# EAGLE design PoElli-at (EAGLE 6.4)
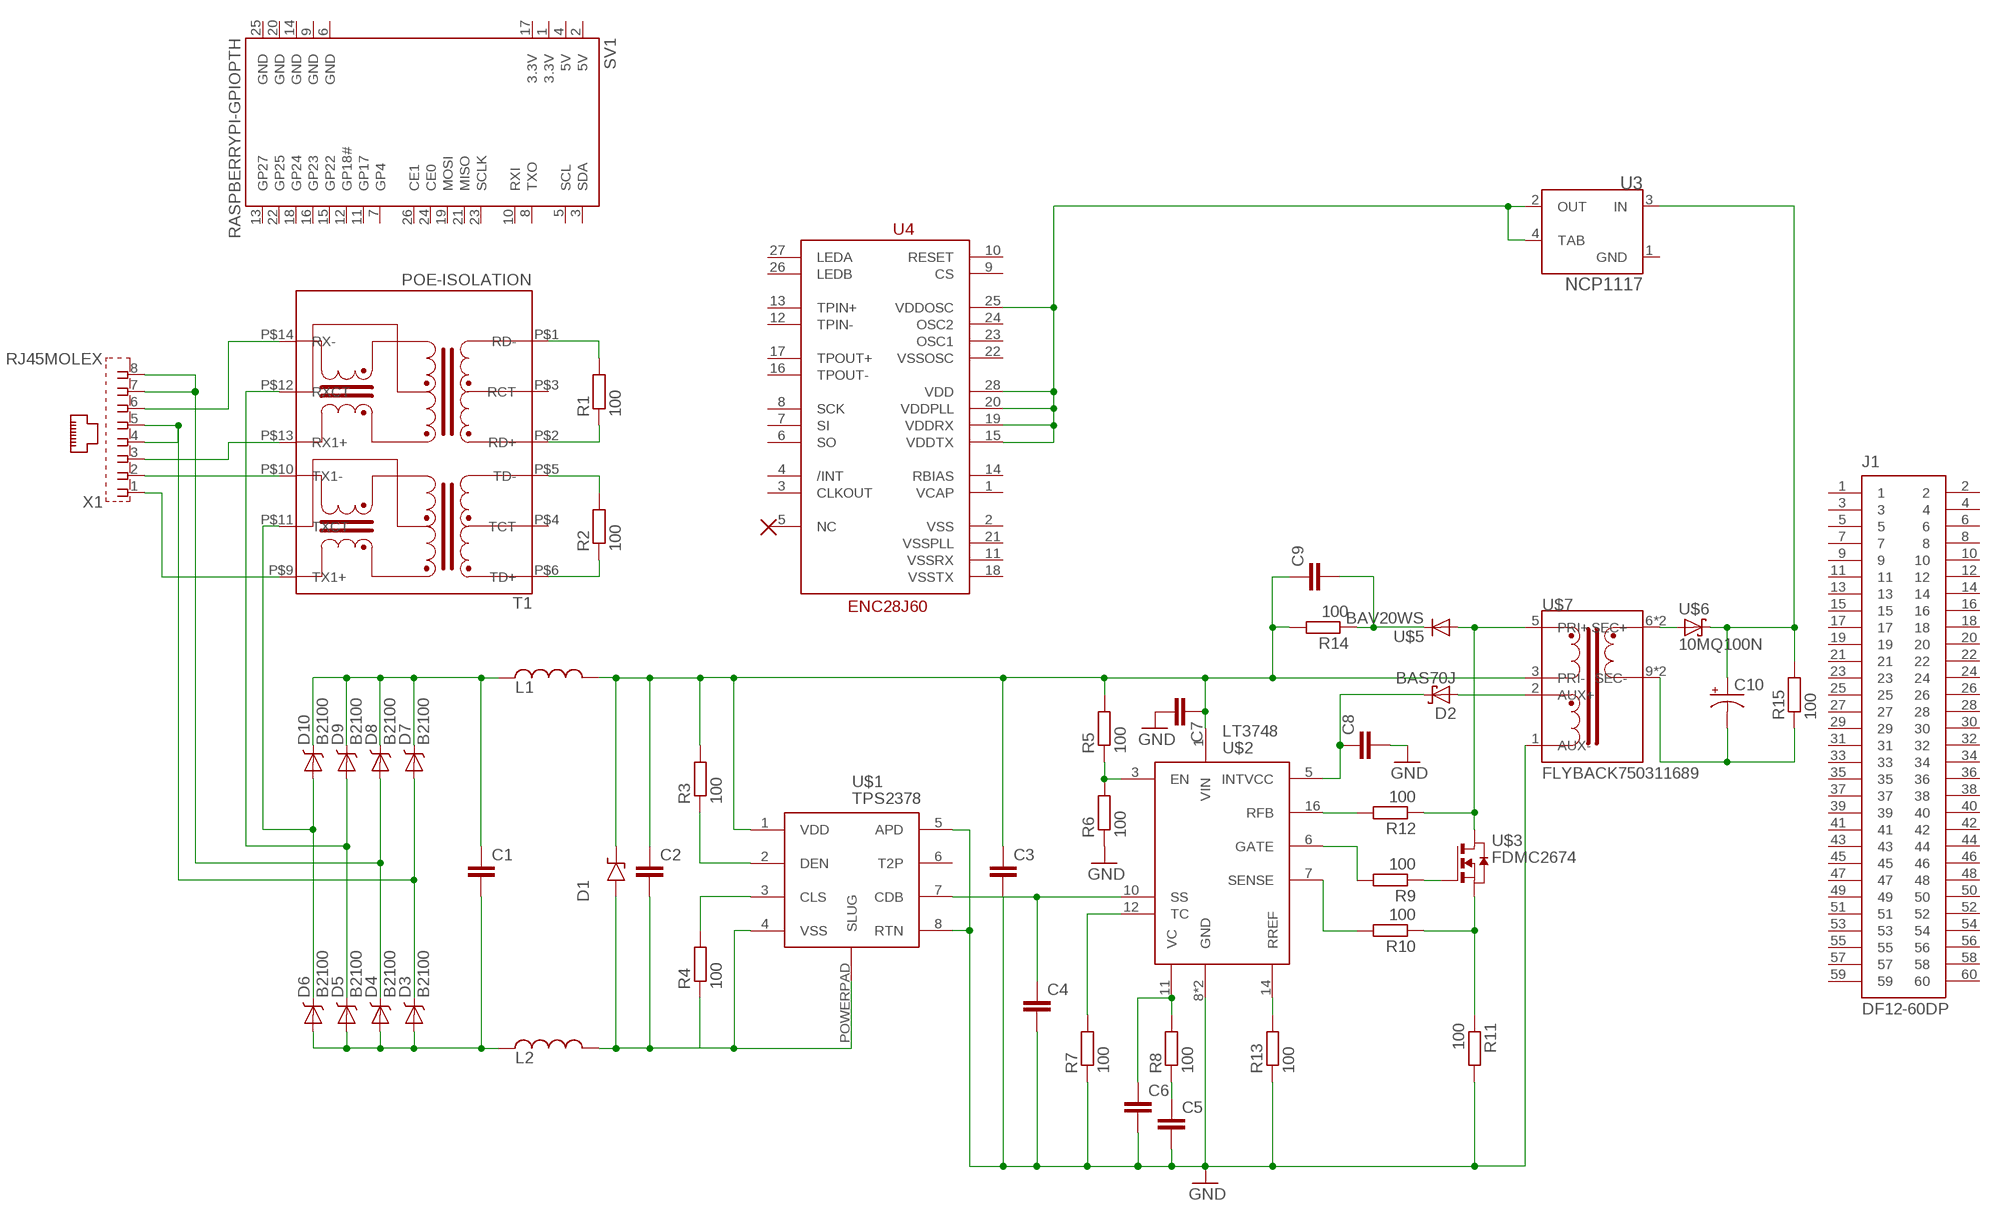
[diagram p0: schematic, sheet 1]

## Parts
C1  C0805  [C0805]
C2  C0805  [C0805]
C3  C0805  [C0805]
C4  C0603  [C0603]
C5  C0402  [C0402]
C6  C0805  [C0805]
C7  C0805  [C0805]
C8  C0805  [C0805]
C9  C0805  [C0805]
C10  CPOL6032  [CT6032]
D1  SMAJ58A  [SMA]
D2  BAS70J  [SOD323]
D3  B2100  DIODE-SCHOTTKYB2100  [DIODE-B2100]
D4  B2100  DIODE-SCHOTTKYB2100  [DIODE-B2100]
D5  B2100  DIODE-SCHOTTKYB2100  [DIODE-B2100]
D6  B2100  DIODE-SCHOTTKYB2100  [DIODE-B2100]
D7  B2100  DIODE-SCHOTTKYB2100  [DIODE-B2100]
D8  B2100  DIODE-SCHOTTKYB2100  [DIODE-B2100]
D9  B2100  DIODE-SCHOTTKYB2100  [DIODE-B2100]
D10  B2100  DIODE-SCHOTTKYB2100  [DIODE-B2100]
J1  DF12-60DP  [DF12(4.0)-60DP-0.5V]
L1  FB  [COILCRAFT-MSS5121]
L2  FB  [COILCRAFT-MSS5121]
R1  100  R0603  [R0603]
R2  100  R0603  [R0603]
R3  100  R0402  [R0402]
R4  100  R0402  [R0402]
R5  100  R0402  [R0402]
R6  100  R0402  [R0402]
R7  100  R0402  [R0402]
R8  100  R0402  [R0402]
R9  100  R0603  [R0603]
R10  100  R0402  [R0402]
R11  100  R1206  [R1206]
R12  100  R0402  [R0402]
R13  100  R0402  [R0402]
R14  100  R0805  [R0805]
R15  100  R0805  [R0805]
SV1  RASPBERRYPI-GPIOPTH  [2X13-SHROUDED]
T1  POE-ISOLATION  [COILCRAFT-ETH1-230L]
U3  NCP1117  [SOT223]
U4  ENC28J60  [SSOP28DB]
U$1  TPS2378  [SO08-POWERPAD]
U$2  LT3748  [MSOP16(12)]
U$3  FDMC2674  [MLP8L33]
U$5  BAV20WS  [SOD323]
U$6  10MQ100N  [DO214AC]
U$7  FLYBACK750311689  [WE_EP13_SMD_10PIN]
X1  RJ45MOLEX  [MOLEX-43860-0001]

## Nets
GND: C3.2 C4.2 C5.2 C6.2 C7.2 C8.2 R6.1 R7.1 R11.2 R13.1 U$1.5(APD) U$1.8(RTN) U$2.8(GND) U$2.9(GND) U$7.1(AUX-)
N$1: T1.P$10(TX1-) X1.2
N$2: T1.P$9(TX1+) X1.1
N$3: T1.P$13(RX1+) X1.3
N$4: T1.P$14(RX-) X1.6
N$5: D4.C D8.A X1.7 X1.8
N$6: C1.1 D7.C D8.C D9.C D10.C L1.1
N$7: D3.C D7.A X1.4 X1.5
N$8: C1.2 D3.A D4.A D5.A D6.A L2.1
N$9: D5.C D9.A T1.P$12(RXCT)
N$10: D6.C D10.A T1.P$11(TXCT)
N$11: R1.2 T1.P$1(RD-)
N$12: R1.1 T1.P$2(RD+)
N$13: R2.2 T1.P$5(TD-)
N$14: R2.1 T1.P$6(TD+)
N$15: C2.2 D1.2(A) L2.2 R4.1 U$1.4(VSS) U$1.POWERPAD(SLUG)
N$16: C2.1 C3.1 C7.1 C9.1 D1.1(C) L1.2 R3.2 R5.2 R14.2 U$1.1(VDD) U$2.1(VIN) U$7.3(PRI-)
N$17: R5.1 R6.2 U$2.3(EN)
N$18: R3.1 U$1.2(DEN)
N$19: R4.2 U$1.3(CLS)
N$20: C4.1 U$1.7(CDB) U$2.10(SS)
N$21: R7.2 U$2.12(TC)
N$22: C6.1 R8.2 U$2.11(VC)
N$23: C5.1 R8.1
N$24: R9.2 U$2.6(GATE)
N$25: R9.1 U$3.4(G)
N$26: R10.2 U$2.7(SENSE)
N$27: R10.1 R11.1 U$3.1(S) U$3.2(S) U$3.3(S)
N$28: R12.1 U$3.5(D) U$3.6(D) U$3.7(D) U$3.8(D) U$3.F1(D) U$5.1(A) U$7.5(PRI+)
N$29: D2.1(A) U$7.2(AUX+)
N$30: C8.1 D2.2(C) U$2.5(INTVCC)
N$31: R12.2 U$2.16(RFB)
N$32: R13.2 U$2.14(RREF)
N$33: C9.2 R14.1 U$5.2(C)
N$34: U$6.A U$7.6(SEC+) U$7.7(SEC+)
N$35: C10.P$1(+) R15.2 U3.3(IN) U$6.C
N$36: C10.P$2(-) R15.1 U$7.9(SEC-) U$7.10(SEC-)
N$37: U3.2(OUT) U3.4(TAB) U4.15(VDDTX) U4.19(VDDRX) U4.20(VDDPLL) U4.25(VDDOSC) U4.28(VDD)
Unconnected: J1.1 J1.2 J1.3 J1.4 J1.5 J1.6 J1.7 J1.8 J1.9 J1.10 J1.11 J1.12 J1.13 J1.14 J1.15 J1.16 J1.17 J1.18 J1.19 J1.20 J1.21 J1.22 J1.23 J1.24 J1.25 J1.26 J1.27 J1.28 J1.29 J1.30 J1.31 J1.32 J1.33 J1.34 J1.35 J1.36 J1.37 J1.38 J1.39 J1.40 J1.41 J1.42 J1.43 J1.44 J1.45 J1.46 J1.47 J1.48 J1.49 J1.50 J1.51 J1.52 J1.53 J1.54 J1.55 J1.56 J1.57 J1.58 J1.59 J1.60 SV1.3(SDA) SV1.5(SCL) SV1.7(GP4) SV1.8(TXO) SV1.10(RXI) SV1.11(GP17) SV1.12(GP18#) SV1.13(GP27) SV1.15(GP22) SV1.16(GP23) SV1.18(GP24) SV1.19(MOSI) SV1.21(MISO) SV1.22(GP25) SV1.23(SCLK) SV1.24(CE0) SV1.26(CE1) T1.P$3(RCT) T1.P$4(TCT) U3.1(GND) U4.1(VCAP) U4.2(VSS) U4.3(CLKOUT) U4.4(/INT) U4.5(NC) U4.6(SO) U4.7(SI) U4.8(SCK) U4.9(CS) U4.10(RESET) U4.11(VSSRX) U4.12(TPIN-) U4.13(TPIN+) U4.14(RBIAS) U4.16(TPOUT-) U4.17(TPOUT+) U4.18(VSSTX) U4.21(VSSPLL) U4.22(VSSOSC) U4.23(OSC1) U4.24(OSC2) U4.26(LEDB) U4.27(LEDA) U$1.6(T2P)

## Power pins joined to a net without a drawn wire
3.3V: SV1.1(3.3V) SV1.17(3.3V)
5V: SV1.2(5V) SV1.4(5V)
GND: SV1.6(GND) SV1.9(GND) SV1.14(GND) SV1.20(GND) SV1.25(GND)

## Library data of the parts
C1-C9 = ELL-i-Passives:C: Surface Mount Capasitors — in standard sizes A capacitor used to store energy electrostatically in an electric field. If you need a high-value capacitor, consider using a polarised capacitor to save space. Wikipedia article on capacitors <https://en.wikipedia.org/wiki/Capacitor>
C10 = ELL-i-Passives:CPOL: Polarized Capacitor — common SMD and some through-hole ones A capacitor used to store energy electrostatically in an electric field. If you need a high-value capacitor, consider using a polarised capacitor to save space. Wikipedia article on capacitors <https://en.wikipedia.org/wiki/Capacitor> These are standard surface mount (SMD) and through-hole (PTH) capacitors. Normally 10uF, 47uF, and 100uF in electrolytic and tantalum varieties. Always verify the external diameter of the through hole cap, it varies with capacity, voltage, and manufacturer. The EIA tantalum devices should have standard packages. Copied from SparkFun-Passives.lbr under SparkFun Creative Commons license. Adopted to EagleUp usage through renaming the packages appropriately.
D1 = ell-i:SMAJ58A
D2 = TPS2378:BAS70: Silicon Schottky Diodes General-purpose diode for high-speed switching
D3-D10 = ELL-i-DIscreteSemi:DIODE-SCHOTTKY: Schottky Diodes A Schottky diode has a low forward voltage drop and a very fast switching action. A normal silicon diode has a voltage drop between 0.6–0.7 volts, while a Schottky diode voltage drop is between approximately 0.15–0.45 volts. This lower voltage drop can provide higher switching speed and better system efficiency. Wikipedia article on Schottky diodes <https://en.wikipedia.org/wiki/Schottky_diode>
J1 = ELL-i-Connectors:DF12-60DP: Hirose DF12 60-pin female (header) 0.5 mm pitch SMT board-to-board connector Datasheet <https://www.sparkfun.com/datasheets/Cellular%20Modules/ADH8066connector.pdf> (from SparkFun)
L1 L2 = ELL-i-Passives:FB: Ferrite beads Ferrite beads are choke coils used to suppress high frequency noise in electronic circuits. Wikipedia article on ferrite beads <https://en.wikipedia.org/wiki/Ferrite_bead>
R1-R15 = ELL-i-Passives:R: Surface Mount Resistor — in standard sizes
SV1 = SparkFun-Boards:RASPBERRYPI-GPIO: RASPBERRY PI I/O HEADER As defined for the Revistion 2 Pi.; DIST: sparkfun; DIST_ID: PRT-11490
T1 = ELL-i-Transformers:POE-ISOLATION: Power-over-Ethernet isolation transformers In twisted pair Ethernet networks, there is a 1500V isolation transformer between the network cable and the connected device. In Power-over-Ethernet devices, the transformer provides the extra function of allowing the DC power to be extracted from the cable-side center taps of the transformer. For high-power PoE, the transformer cable-side winding must be of thick enough wire (i.e. have low-enough resistance) to carry the DC current without warming up too much. Isolation transformers <https://en.wikipedia.org/wiki/Isolation_transformer> (general article) Power-over-Ethernet <https://en.wikipedia.org/wiki/Power_over_Ethernet> (general article)
U3 = ell-i:NCP1117
U4 = SparkFun-DigitalIC:ENC28J60: Microchip SPI 10Base ethernet IC
U$1 = ELL-i-PowerIC:TPS2378: TI 802.3at Power-over-Ethernet controller with an integrated FET This IC contains all of the features needed to implement an IEEE802.3at type-2 powered device (PD). It includes an 0.5 Ω RDSON Power FET, which enables continuous 0.85 A current. It supports also auxiliary power. Product page <http://www.ti.com/product/tps2378> Datasheet <http://www.ti.com/lit/gpn/tps2378> Wiki page <https://github.com/Ell-i/ELL-i-Eagle-Libraries/wiki/PowerIC-TPS2378>
U$2 = ELL-i-PowerIC:LT3748: 100V Isolated Flyback Controller A switching regulator controller designed for the isolated flyback topology. Drives an external N-channel power MOSFET from an internally regulated 7V supply. No third winding or opto-isolator are required. Product page <http://www.linear.com/product/LT3748> Datasheet <http://www.linear.com/docs/29653> Wiki page <https://github.com/Ell-i/ELL-i-Eagle-Libraries/wiki/PowerIC-LT3748>
U$3 = ELL-i-DIscreteSemi:FDMC2674: 220V N-Channel UltraFET Trench MOSFET This is a power MOSFET, capable of passing 2A of current and lasting some 200V, in a small MLP package. For a typical flyback converter, you need the switching FET to last much higher voltage than the nominal primary side voltage, as the flyback generates a high parasitic voltage at the time the FET switches off, before the so-called snubber circuit is able to absorb it. Datasheet <http://www.fairchildsemi.com/ds/FD/FDMC2674.pdf‎>
U$5 = TPS2378:BAV20WS
U$6 = TPS2378:10MQ100N
U$7 = ELL-i-Transformers:FLYBACK: Flyback SMPS transformer These types of transformers are often used in flyback and forward SMPS converters. The primary-side auxillary winding typically used to generate a 7-12 V auxillary voltage, which is used to generate the operating voltage (VCC) for the SMPS controller chip. The packages includes the ones used at various ELL-i boards.
X1 = ELL-i-Connectors:RJ45: RJ45 Modular Jack This is the plain RJ-45 plug, without Ethernet magnetics, in various packages. For a variant with built-in magnetics, see MAGJACK. This connector is common for Cat5, Cat5e, and Cat6 Ethernet cables.; OC_FARNELL: unknown; OC_NEWARK: unknown

## Board
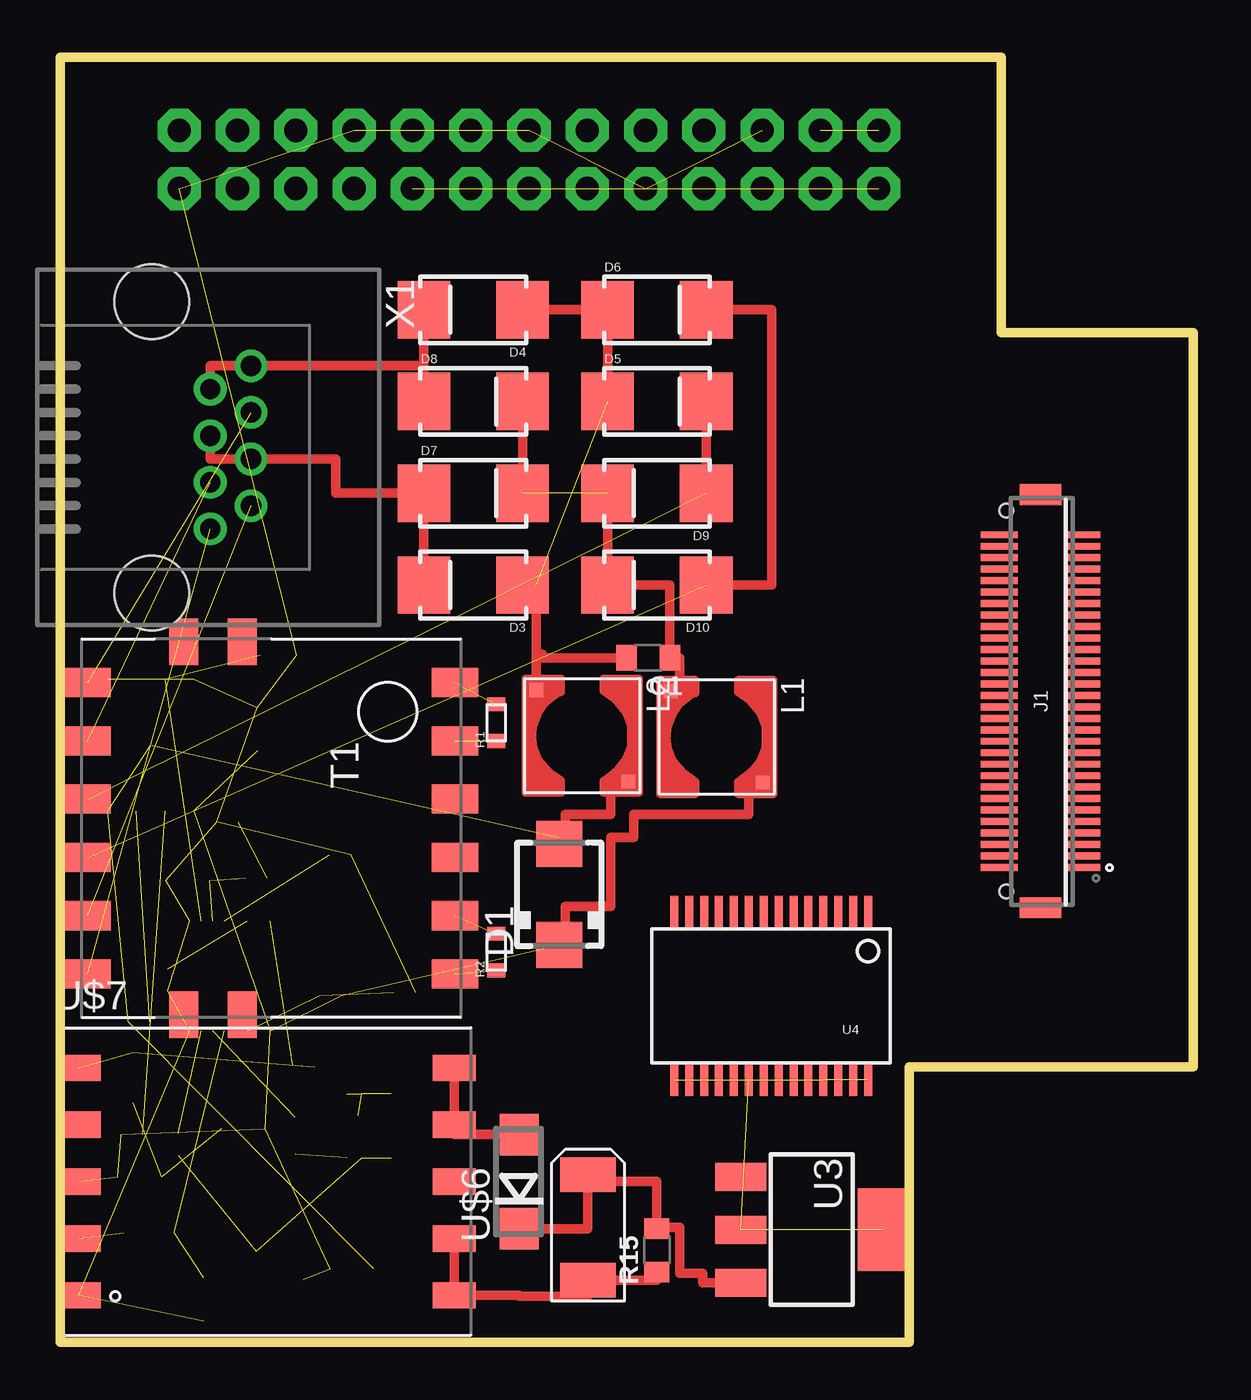
[diagram p1: board, top side]
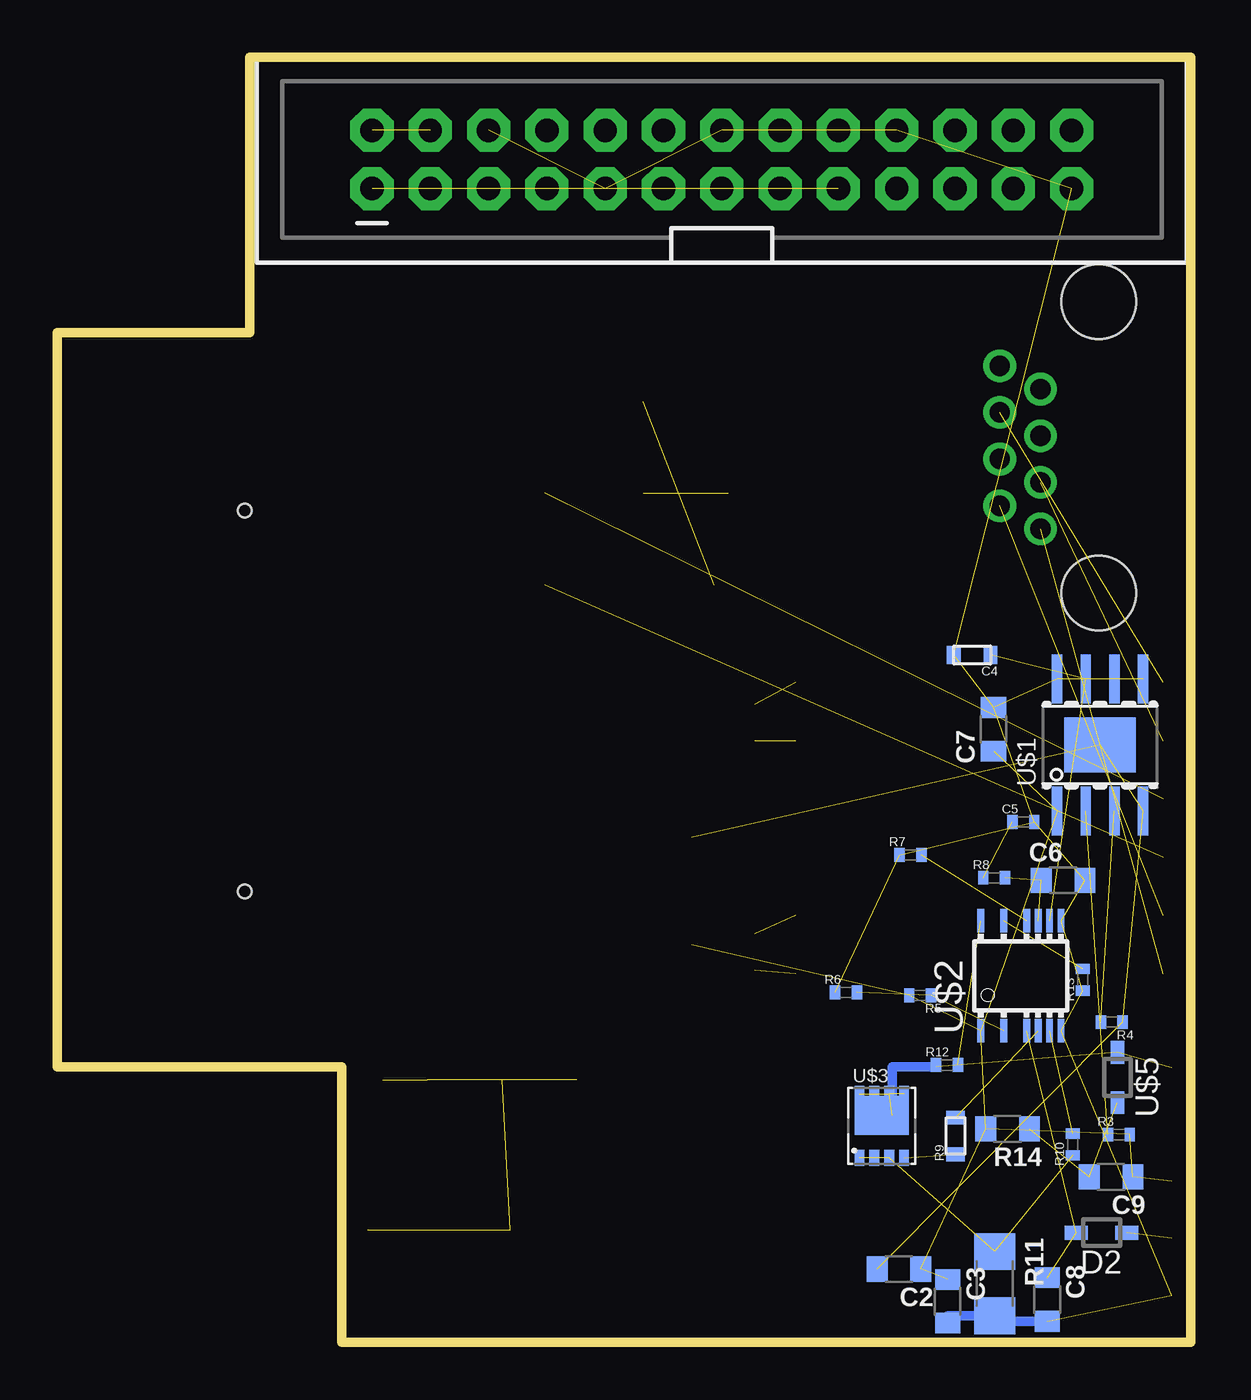
[diagram p2: board, bottom side, seen from below]

Size 49.38 x 56 mm. Coordinates in mm from the lower left corner, seen from the top.
Outline: 0,0 0,56 41,56 41,44 49.38,44 49.38,12 37,12 37,0 0,0
Copper layers (1*16): Top 0.035mm / dielectric 1.5mm / Bottom 0.035mm
Design rules "default": minimum track width 10mil, minimum drill 24mil, track to track 8mil, track to pad 8mil, pad to pad 8mil, via to via 8mil, smd to smd 8mil, copper to edge 40mil, drill to drill 8mil, minimum pad ring 10mil, minimum via ring 8mil, stop-mask expansion 4mil, vias tented up to drill 0mil, thermal gap 10mil

### Footprints (pad centres in the part's own frame; a part is rotated, then mirrored left to right if it is on the bottom)
C0805 = smd 0.9 x 1.1: 1 -0.95,0; 2 0.95,0
C0603 = smd 0.6 x 0.8: 1 -0.8,0; 2 0.8,0
C0402 = smd 0.45 x 0.6: 1 -0.475,0; 2 0.475,0
CT6032 = smd 1.5 x 2.4: P$1 -2.3,0; P$2 2.3,0
SMA = smd 2 x 2: 1 -2.2,0; 2 2.2,0
SOD323 = smd 1 x 0.6: 1 -1.1,0; 2 1.1,0
DIODE-B2100 = smd 2.3 x 2.5: A -2.15,0; C 2.15,0
DF12(4.0)-60DP-0.5V = smd 0.3 x 1.6: 1 -7.25,-1.8; 2 -7.25,1.8; 3 -6.75,-1.8; 4 -6.75,1.8; 5 -6.25,-1.8; 6 -6.25,1.8; 7 -5.75,-1.8; 8 -5.75,1.8; 9 -5.25,-1.8; 10 -5.25,1.8; 11 -4.75,-1.8; 12 -4.75,1.8; 13 -4.25,-1.8; 14 -4.25,1.8; 15 -3.75,-1.8; 16 -3.75,1.8; 17 -3.25,-1.8; 18 -3.25,1.8; 19 -2.75,-1.8; 20 -2.75,1.8; 21 -2.25,-1.8; 22 -2.25,1.8; 23 -1.75,-1.8; 24 -1.75,1.8; 25 -1.25,-1.8; 26 -1.25,1.8; 27 -0.75,-1.8; 28 -0.75,1.8; 29 -0.25,-1.8; 30 -0.25,1.8; 31 0.25,-1.8; 32 0.25,1.8; 33 0.75,-1.8; 34 0.75,1.8; 35 1.25,-1.8; 36 1.25,1.8; 37 1.75,-1.8; 38 1.75,1.8; 39 2.25,-1.8; 40 2.25,1.8; 41 2.75,-1.8; 42 2.75,1.8; 43 3.25,-1.8; 44 3.25,1.8; 45 3.75,-1.8; 46 3.75,1.8; 47 4.25,-1.8; 48 4.25,1.8; 49 4.75,-1.8; 50 4.75,1.8; 51 5.25,-1.8; 52 5.25,1.8; 53 5.75,-1.8; 54 5.75,1.8; 55 6.25,-1.8; 56 6.25,1.8; 57 6.75,-1.8; 58 6.75,1.8; 59 7.25,-1.8; 60 7.25,1.8 | smd 0.9 x 1.8: F1 -9,0; F2 9,0 | hole 0.6: -8.3,1.5; 8.3,1.5
COILCRAFT-MSS5121 = smd 0.6 x 0.6: 1 -2,-2; 2 2,2
R0603 = smd 0.6 x 0.8: 1 -0.8,0; 2 0.8,0
R0402 = smd 0.45 x 0.6: 1 -0.475,0; 2 0.475,0
R1206 = smd 1.6 x 1.8: 1 -1.4,0; 2 1.4,0
R0805 = smd 0.9 x 1.1: 1 -0.95,0; 2 0.95,0
2X13-SHROUDED = drill 1.016 pad 1.88 octagon: 1 -1.27,15.24; 2 1.27,15.24; 3 -1.27,12.7; 4 1.27,12.7; 5 -1.27,10.16; 6 1.27,10.16; 7 -1.27,7.62; 8 1.27,7.62; 9 -1.27,5.08; 10 1.27,5.08; 11 -1.27,2.54; 12 1.27,2.54; 13 -1.27,0; 14 1.27,0; 15 -1.27,-2.54; 16 1.27,-2.54; 17 -1.27,-5.08; 18 1.27,-5.08; 19 -1.27,-7.62; 20 1.27,-7.62; 21 -1.27,-10.16; 22 1.27,-10.16; 23 -1.27,-12.7; 24 1.27,-12.7; 25 -1.27,-15.24; 26 1.27,-15.24
COILCRAFT-ETH1-230L = smd 1.27 x 2.032: P$1 -6.35,8.001; P$2 -3.81,8.001; P$3 -1.27,8.001; P$4 1.27,8.001; P$5 3.81,8.001; P$6 6.35,8.001; P$9 6.35,-8.001; P$10 3.81,-8.001; P$11 1.27,-8.001; P$12 -1.27,-8.001; P$13 -3.81,-8.001; P$14 -6.35,-8.001 | smd 2.032 x 1.27: P$7 8.128,-1.27; P$8 8.128,-3.81; P$15 -8.128,-3.81; P$16 -8.128,-1.27
SOT223 = smd 1.219 x 2.235: 1 -2.311,-3.099; 2 0,-3.099; 3 2.311,-3.099 | smd 3.6 x 2.2: 4 0,3.099
SSOP28DB = smd 0.348 x 1.397: 1 -4.225,-3.656; 2 -3.575,-3.656; 3 -2.925,-3.656; 4 -2.275,-3.656; 5 -1.625,-3.656; 6 -0.975,-3.656; 7 -0.325,-3.656; 8 0.325,-3.656; 9 0.975,-3.656; 10 1.625,-3.656; 11 2.275,-3.656; 12 2.925,-3.656; 13 3.575,-3.656; 14 4.225,-3.656; 15 4.225,3.656; 16 3.575,3.656; 17 2.925,3.656; 18 2.275,3.656; 19 1.625,3.656; 20 0.975,3.656; 21 0.325,3.656; 22 -0.325,3.656; 23 -0.975,3.656; 24 -1.625,3.656; 25 -2.275,3.656; 26 -2.925,3.656; 27 -3.575,3.656; 28 -4.225,3.656
SO08-POWERPAD = smd 0.45 x 2.15: 1 -1.875,-2.875; 2 -0.625,-2.875; 3 0.625,-2.875; 4 1.875,-2.875; 5 1.875,2.875; 6 0.625,2.875; 7 -0.625,2.875; 8 -1.875,2.875 | smd 3.1 x 2.4: POWERPAD 0,0
MSOP16(12) = smd 0.3 x 1.02: 1 -1.75,-2.4; 3 -0.75,-2.4; 5 0.25,-2.4; 6 0.75,-2.4; 7 1.25,-2.4; 8 1.75,-2.4; 9 1.75,2.4; 10 1.25,2.4; 11 0.75,2.4; 12 0.25,2.4; 14 -0.75,2.4; 16 -1.75,2.4
MLP8L33 = smd 0.42 x 0.7: 1 -0.975,-1.4; 2 -0.325,-1.4; 3 0.325,-1.4; 4 0.975,-1.4; 5 0.975,1.4; 6 0.325,1.4; 7 -0.325,1.4; 8 -0.975,1.4 | smd 2.37 x 1.7: F1 0,0.45
DO214AC = smd 1.8 x 1.7: A 2.05,0; C -2.05,0
WE_EP13_SMD_10PIN = smd 1.88 x 1.143: 1 -8.18,-4.96; 2 -8.18,-2.48; 3 -8.18,0; 4 -8.18,2.48; 5 -8.18,4.96; 6 8.18,4.96; 7 8.18,2.48; 8 8.18,0; 9 8.18,-2.48; 10 8.18,-4.96
MOLEX-43860-0001 = drill 0.889 pad 1.422: 1 3.556,2.54; 2 2.54,4.318; 3 1.524,2.54; 4 0.508,4.318; 5 -0.508,2.54; 6 -1.524,4.318; 7 -2.54,2.54; 8 -3.556,4.318 | hole 3.251: 6.35,0; -6.35,0

### Placement (x,y rotation side)
C1  25.62,29.83 180 top
C2  12.71,3.19 180 bottom
C3  10.59,1.78 270 bottom
C4  9.52,29.95 180 bottom
C5  7.29,22.67 0 bottom
C6  5.56,20.13 0 bottom
C7  8.59,26.71 90 bottom
C8  6.25,1.86 270 bottom
C9  3.47,7.21 180 bottom
C10  23,5 270 top
D1  21.75,19.52 90 top
D2  3.88,4.77 180 bottom
D3  18,33 180 top
D4  18,45 180 top
D5  26,41 0 top
D6  26,45 0 top
D7  18,37 0 top
D8  18,41 0 top
D9  26,37 180 top
D10  26,33 180 top
J1  42.72,27.94 90 top
L1  28.61,26.38 270 top
L2  22.75,26.43 270 top
R1  19,27 90 top
R2  19,17 90 top
R3  3.13,9.05 0 bottom
R4  3.44,13.95 180 bottom
R5  11.79,15.11 180 bottom
R6  15.02,15.24 0 bottom
R7  12.21,21.24 0 bottom
R8  8.56,20.24 0 bottom
R9  10.24,8.99 90 bottom
R10  5.14,8.62 90 bottom
R11  8.54,2.55 270 bottom
R12  10.62,12.08 0 bottom
R13  4.7,15.79 90 bottom
R14  7.98,9.3 180 bottom
R15  26,4 90 top
SV1  20.43,51.55 90 bottom
T1  9.2,22.4 270 top
U3  32.75,4.9 270 top
U4  30.98,15.09 180 top
U$1  3.95,26.03 0 bottom
U$2  7.4,15.97 0 bottom
U$3  13.46,9.43 0 bottom
U$5  3.19,11.54 270 bottom
U$6  20,7 90 top
U$7  9,7 0 top
X1  4,39 270 top

### Tracks (layer width: path | path; a pad name or v marks a point on that pad's centre or on a via)
3.3V  (1 unrouted)
5V  (1 unrouted)
GND  (17 unrouted)
  Bottom 0.406: C8.2 8.54,0.91 R11.2 10.59,1.15 C3.2
N$1  (1 unrouted)
N$2  (1 unrouted)
N$3  (1 unrouted)
N$4  (1 unrouted)
N$5
  Top 0.406: D8.A 15.85,42.56 | 15.85,42.56 D4.C | 15.85,42.56 X1.8 6.54,42.56 X1.7
N$6  (1 unrouted)
  Top 0.406: D8.C D7.C | D9.C D10.C 26.57,33 C1.1 27,29.83 27,28.38 | L1.1 27,28.38 | 27,28.38 27,28
N$7
  Top 0.406: D3.C D7.A 12,37 12,38.49 X1.4 6.54,38.49 X1.5
N$8  (1 unrouted)
  Top 0.406: D4.A D6.A D5.A | C1.2 21,29.83 21,30 20.75,30 | 20.75,30 L2.1 | D3.A 20.75,33 20.75,30
N$9  (1 unrouted)
  Top 0.406: D5.C D9.A
N$10  (1 unrouted)
  Top 0.406: D6.C 31,45 31,33 D10.A
N$11  (1 unrouted)
N$12  (1 unrouted)
N$13  (1 unrouted)
N$14  (1 unrouted)
N$15  (4 unrouted)
  Top 0.406: L2.2 24,24.43 24,23 22,23 22,22 21.75,22 D1.2
N$16  (10 unrouted)
  Top 0.406: D1.1 22,17.32 22,19 24,19 24,22 25,22 25,23 30,23 30,24 30.61,24 L1.2
N$17  (2 unrouted)
N$18  (1 unrouted)
N$19  (1 unrouted)
N$20  (2 unrouted)
N$21  (1 unrouted)
N$22  (2 unrouted)
N$23  (1 unrouted)
N$24  (1 unrouted)
N$25  (1 unrouted)
N$26  (1 unrouted)
N$27  (4 unrouted)
N$28  (6 unrouted)
  Bottom 0.406: U$3.F1 13,9.88 13,12 11.1,12 R12.1
N$29  (1 unrouted)
N$30  (2 unrouted)
N$31  (1 unrouted)
N$32  (1 unrouted)
N$33  (2 unrouted)
N$34
  Top 0.406: U$6.A 17.18,9.05 U$7.7 U$7.6
N$35
  Top 0.406: U3.3 28,2.59 28,3 27,3 27,5 26,5 R15.2 26,7 23,7 C10.P$1 23,4.95 U$6.C
N$36
  Top 0.406: R15.1 26,2.7 C10.P$2 23,2 20,2 20,2.04 U$7.10 U$7.9
N$37  (6 unrouted)